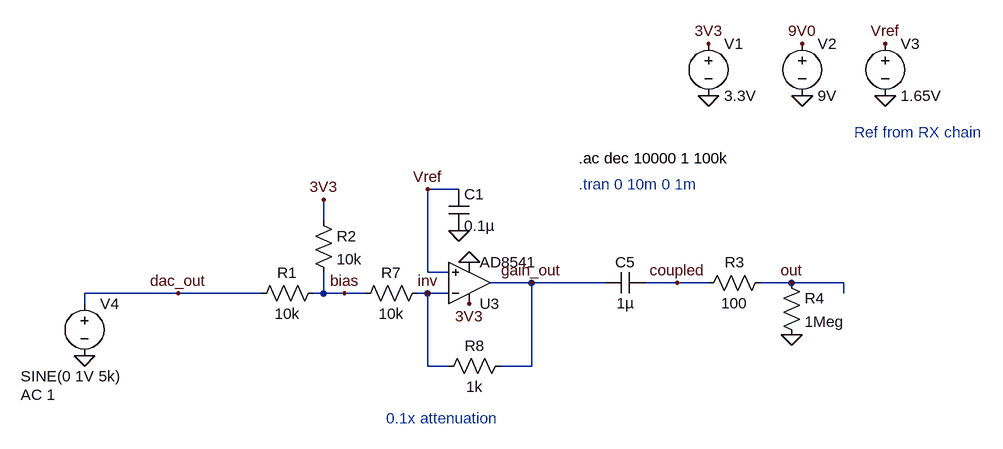
[diagram p0: schematic analog_tx.asc]
analog_tx.asc, the LTspice schematic file:
Version 4.1
SHEET 1 1720 680
WIRE -192 -160 -240 -160
WIRE -400 -112 -400 -144
WIRE -240 -32 -240 -160
WIRE -208 -32 -240 -32
WIRE -80 -16 -144 -16
WIRE 32 -16 -80 -16
WIRE 144 -16 96 -16
WIRE 192 -16 144 -16
WIRE 320 -16 272 -16
WIRE 400 -16 320 -16
WIRE -624 0 -768 0
WIRE -496 0 -624 0
WIRE -400 0 -400 -32
WIRE -400 0 -416 0
WIRE -368 0 -400 0
WIRE -336 0 -368 0
WIRE -240 0 -256 0
WIRE -208 0 -240 0
WIRE 400 0 400 -16
WIRE -768 16 -768 0
WIRE -240 112 -240 0
WIRE -208 112 -240 112
WIRE -80 112 -80 -16
WIRE -80 112 -128 112
FLAG 336 -304 0
FLAG 192 -304 0
FLAG 336 -384 9V0
FLAG 192 -384 3V3
FLAG -80 -16 gain_out
FLAG -176 16 3V3
FLAG -176 -48 0
FLAG -624 0 dac_out
FLAG -768 96 0
FLAG -368 0 bias
FLAG -400 -144 3V3
FLAG 144 -16 coupled
FLAG 320 -16 out
FLAG 320 64 0
FLAG 464 -304 0
FLAG -240 0 inv
FLAG -192 -96 0
FLAG 464 -384 Vref
FLAG -240 -160 Vref
SYMBOL voltage 192 -400 R0
SYMATTR InstName V1
SYMATTR Value 3.3V
SYMBOL voltage 336 -400 R0
SYMATTR InstName V2
SYMATTR Value 9V
SYMBOL cap 96 -32 R90
WINDOW 0 0 32 VBottom 2
WINDOW 3 32 32 VTop 2
SYMATTR InstName C5
SYMATTR Value 1µ
SYMBOL voltage -768 0 R0
WINDOW 3 -98 128 Left 2
WINDOW 123 -98 156 Left 2
WINDOW 39 0 0 Left 0
SYMATTR Value SINE(0 1V 5k)
SYMATTR Value2 AC 1
SYMATTR InstName V4
SYMBOL OpAmps\\AD8541 -176 48 M180
SYMATTR InstName U3
SYMBOL res -400 -16 R90
WINDOW 0 0 56 VBottom 2
WINDOW 3 32 56 VTop 2
SYMATTR InstName R1
SYMATTR Value 10k
SYMBOL res -416 -128 R0
SYMATTR InstName R2
SYMATTR Value 10k
SYMBOL res 288 -32 R90
WINDOW 0 0 56 VBottom 2
WINDOW 3 32 56 VTop 2
SYMATTR InstName R3
SYMATTR Value 100
SYMBOL res 304 -32 R0
SYMATTR InstName R4
SYMATTR Value 1Meg
SYMBOL res -240 -16 R90
WINDOW 0 0 56 VBottom 2
WINDOW 3 32 56 VTop 2
SYMATTR InstName R7
SYMATTR Value 10k
SYMBOL voltage 464 -400 R0
SYMATTR InstName V3
SYMATTR Value 1.65V
SYMBOL res -112 96 R90
WINDOW 0 0 56 VBottom 2
WINDOW 3 32 56 VTop 2
SYMATTR InstName R8
SYMATTR Value 1k
SYMBOL cap -208 -160 R0
SYMATTR InstName C1
SYMATTR Value 0.1µ
TEXT -8 -208 Left 2 !.ac dec 10000 1 100k
TEXT -8 -168 Left 2 ;.tran 0 10m 0 1m
TEXT -304 192 Left 2 ;0.1x attenuation
TEXT 416 -248 Left 2 ;Ref from RX chain

The netlist it stands for:
* analog_tx.asc
V1 3V3 0 3.3V
V2 9V0 0 9V
C5 coupled gain_out 1µ
V4 dac_out 0 SINE(0 1V 5k) AC 1
X§U3 Vref inv 3V3 0 gain_out AD8541  ; pins In+ In- V+ V- OUT
R1 bias dac_out 10k
R2 3V3 bias 10k
R3 out coupled 100
R4 out 0 1Meg
R7 inv bias 10k
V3 Vref 0 1.65V
R8 gain_out inv 1k
C1 Vref 0 0.1µ
.ac dec 10000 1 100k
* .tran 0 10m 0 1m
* 0.1x attenuation
* Ref from RX chain
.backanno
.end